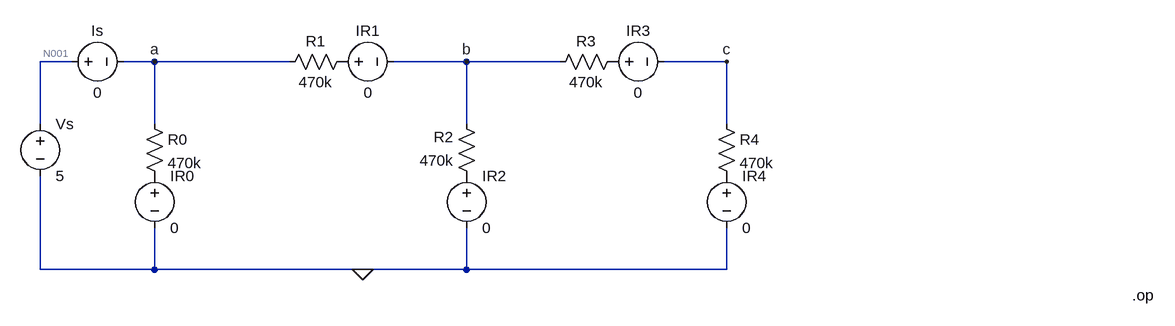
[diagram p0: schematic Lab08.asc]
Lab08.asc, the LTspice schematic file:
Version 4
SHEET 1 1752 680
WIRE 80 32 32 32
WIRE 208 32 160 32
WIRE 416 32 208 32
WIRE 688 32 576 32
WIRE 832 32 688 32
WIRE 1088 32 992 32
WIRE 32 128 32 32
WIRE 208 128 208 32
WIRE 688 128 688 32
WIRE 1088 128 1088 32
WIRE 32 352 32 208
WIRE 208 352 208 288
WIRE 208 352 32 352
WIRE 528 352 208 352
WIRE 688 352 688 288
WIRE 688 352 528 352
WIRE 1088 352 1088 288
WIRE 1088 352 688 352
FLAG 208 32 a
FLAG 688 32 b
FLAG 1088 32 c
FLAG 528 352 0
SYMBOL voltage 32 112 R0
SYMATTR InstName Vs
SYMATTR Value 5
SYMBOL res 192 112 R0
SYMATTR InstName R0
SYMATTR Value 470k
SYMBOL res 512 16 R90
WINDOW 0 0 56 VBottom 2
WINDOW 3 32 56 VTop 2
SYMATTR InstName R1
SYMATTR Value 470k
SYMBOL res 704 224 R180
WINDOW 0 36 76 Left 2
WINDOW 3 36 40 Left 2
SYMATTR InstName R2
SYMATTR Value 470k
SYMBOL res 816 48 R270
WINDOW 0 32 56 VTop 2
WINDOW 3 0 56 VBottom 2
SYMATTR InstName R3
SYMATTR Value 470k
SYMBOL res 1072 112 R0
SYMATTR InstName R4
SYMATTR Value 470k
SYMBOL voltage 208 192 R0
SYMATTR InstName IR0
SYMATTR Value 0
SYMBOL voltage 688 192 R0
SYMATTR InstName IR2
SYMATTR Value 0
SYMBOL voltage 1088 192 R0
SYMATTR InstName IR4
SYMATTR Value 0
SYMBOL voltage 896 32 R270
WINDOW 0 32 56 VTop 2
WINDOW 3 -32 56 VBottom 2
SYMATTR InstName IR3
SYMATTR Value 0
SYMBOL voltage 480 32 R270
WINDOW 0 32 56 VTop 2
WINDOW 3 -32 56 VBottom 2
SYMATTR InstName IR1
SYMATTR Value 0
SYMBOL voltage 64 32 R270
WINDOW 0 32 56 VTop 2
WINDOW 3 -32 56 VBottom 2
SYMATTR InstName Is
SYMATTR Value 0
TEXT 1712 392 Left 2 !.op

The netlist it stands for:
* Lab08.asc
Vs N001 0 5
R0 a P001 470k
R1 P002 a 470k
R2 P003 b 470k
R3 b P004 470k
R4 c P005 470k
V§IR0 P001 0 0
V§IR2 P003 0 0
V§IR4 P005 0 0
V§IR3 P004 c 0
V§IR1 P002 b 0
V§Is N001 a 0
.op
.backanno
.end

* Results of the author's LTspice run, read from the files saved beside the schematic
* Operating Point:
*   V(n001) = 5 V
*   V(a) = 5 V
*   V(p001) = 0 V
*   V(p002) = 2 V
*   V(p003) = 0 V
*   V(b) = 2 V
*   V(p004) = 1 V
*   V(c) = 1 V
*   V(p005) = 0 V
*   I(R0) = 10.64 µA
*   I(R1) = -6.383 µA
*   I(R2) = -4.255 µA
*   I(R3) = 2.128 µA
*   I(R4) = 2.128 µA
*   I(Vs) = -17.02 µA
*   I(Ir0) = 10.64 µA
*   I(Ir2) = 4.255 µA
*   I(Ir4) = 2.128 µA
*   I(Ir3) = 2.128 µA
*   I(Ir1) = 6.383 µA
*   I(Is) = 17.02 µA